# EasyEDA schematic SCH_STM32F401CCU6_UNI.json
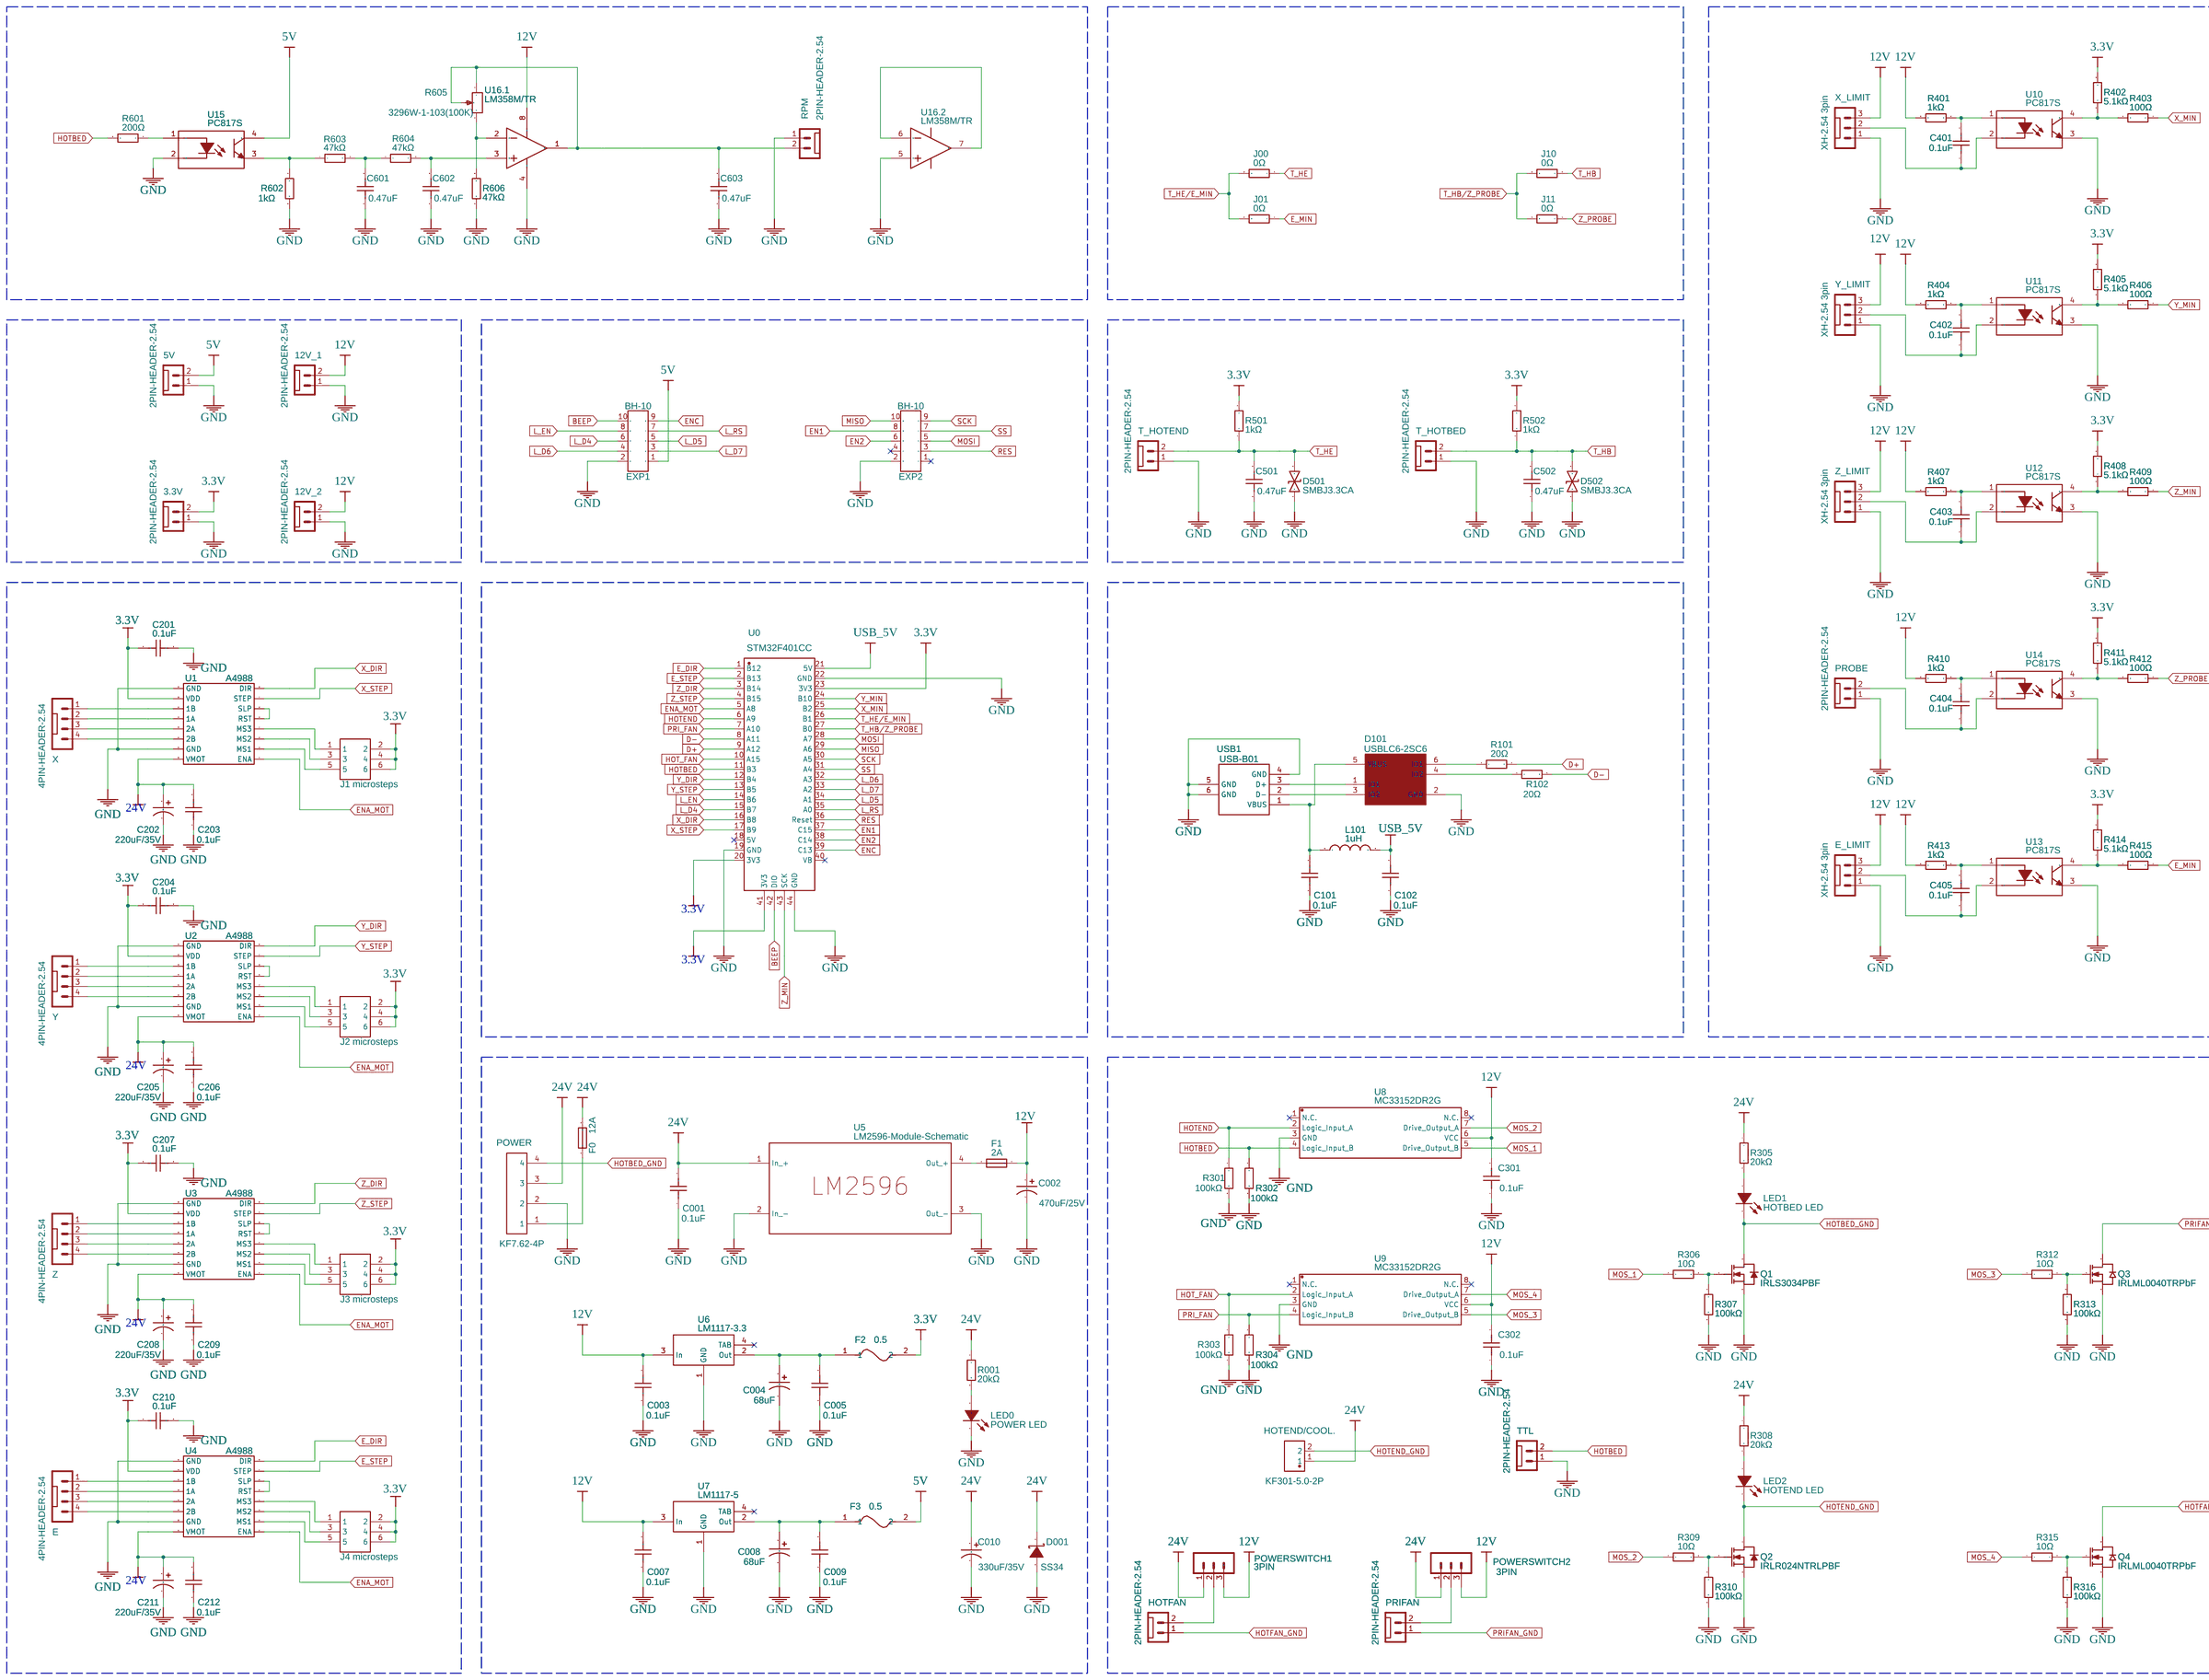
[diagram p0: schematic sheet]

## Parts
3.3V  2PIN-HEADER-2.54  [JST-2.54-2PIN-CONNECTOR]
5V  2PIN-HEADER-2.54  [JST-2.54-2PIN-CONNECTOR]
12V_1  2PIN-HEADER-2.54  [JST-2.54-2PIN-CONNECTOR]
12V_2  2PIN-HEADER-2.54  [JST-2.54-2PIN-CONNECTOR]
C001  0.1uF  [C0805]
C002  470uF/25V  [CAP-TH_W10.0_P5.0_D0.6_220UF_35V]
C003  0.1uF  [C0805]
C004  68uF  [CASE-B_3528]
C005  0.1uF  [C0805]
C007  0.1uF  [C0805]
C008  68uF  [CASE-B_3528]
C009  0.1uF  [C0805]
C010  330uF/35V  [CAP-TH_W10.0_P5.0_D0.6_220UF_35V]
C101  0.1uF  [C0805]
C102  0.1uF  [C0805]
C201  0.1uF  [C0805]
C202  220uF/35V  [CAP-TH_W8.0_P3.5_D0.6_220UF_35V]
C203  0.1uF  [C0805]
C204  0.1uF  [C0805]
C205  220uF/35V  [CAP-TH_W8.0_P3.5_D0.6_220UF_35V]
C206  0.1uF  [C0805]
C207  0.1uF  [C0805]
C208  220uF/35V  [CAP-TH_W8.0_P3.5_D0.6_220UF_35V]
C209  0.1uF  [C0805]
C210  0.1uF  [C0805]
C211  220uF/35V  [CAP-TH_W8.0_P3.5_D0.6_220UF_35V]
C212  0.1uF  [C0805]
C301  0.1uF  [C0805]
C302  0.1uF  [C0805]
C401  0.1uF  [C0805]
C402  0.1uF  [C0805]
C403  0.1uF  [C0805]
C404  0.1uF  [C0805]
C405  0.1uF  [C0805]
C501  0.47uF  [1206]
C502  0.47uF  [1206]
C601  0.47uF  [1206]
C602  0.47uF  [1206]
C603  0.47uF  [1206]
D001  SS34  [SMA_L4.3-W2.6-LS5.2-RD]
D101  USBLC6-2SC6  [SOT-23-6]
D501  SMBJ3.3CA  [SMB_L4.4-W3.6-LS5.3-BI]
D502  SMBJ3.3CA  [SMB_L4.4-W3.6-LS5.3-BI]
E  4PIN-HEADER-2.54  [CON-XH2.54-4PIN]
E_LIMIT  XH-2.54 3pin  [CONN-TH_XH2.54_3PIN]
EXP1  BH-10  [BH-10_ATMEL]
EXP2  BH-10  [BH-10_ATMEL]
F0  12A  [FUSE-SMD_L6.1-W2.7]
F1  2A  [FUSE-SMD_L6.1-W2.7]
F2  0.5  [SMD RESETABLE FUSE 3216]
F3  0.5  [SMD RESETABLE FUSE 3216]
HOTEND/COOL.  KF301-5.0-2P  [CONN-TH_P5.00_KF301-5.0-2P]
HOTFAN  2PIN-HEADER-2.54  [JST-2.54-2PIN-CONNECTOR]
J00  0Ω  [R0805]
J1  microsteps  [HDR-2X3-2.54-MALE]
J2  microsteps  [HDR-2X3-2.54-MALE]
J3  microsteps  [HDR-2X3-2.54-MALE]
J4  microsteps  [HDR-2X3-2.54-MALE]
J10  0Ω  [R0805]
J11  0Ω  [R0805]
L101  1uH  [INDUCTOR-1206]
LED0  POWER LED  [LED1206-R-RD]
LED1  HOTBED LED  [LED1206-R-RD]
LED2  HOTEND LED  [LED1206-R-RD]
POWER  KF7.62-4P  [KF7.62-4P]
POWERSWITCH1  3PIN  [3PIN-HEADER]
POWERSWITCH2  3PIN  [3PIN-HEADER]
PRIFAN  2PIN-HEADER-2.54  [JST-2.54-2PIN-CONNECTOR]
PROBE  2PIN-HEADER-2.54  [JST-2.54-2PIN-CONNECTOR]
Q1  IRLS3034PBF  [IRLS3034PBF_D2PAK]
Q2  IRLR024NTRLPBF  [DPAK_L6.5-W6.0-P2.29-LS9.9-TL]
Q3  IRLML0040TRPbF  [SOT-23_L2.9-W1.3-P1.90-LS2.4-BR]
Q4  IRLML0040TRPbF  [SOT-23_L2.9-W1.3-P1.90-LS2.4-BR]
R001  20kΩ  [R0805]
R101  20Ω  [R0805]
R102  20Ω  [R0805]
R301  100kΩ  [R0805]
R302  100kΩ  [R0805]
R303  100kΩ  [R0805]
R304  100kΩ  [R0805]
R305  20kΩ  [R0805]
R306  10Ω  [R0805]
R307  100kΩ  [R0805]
R308  20kΩ  [R0805]
R309  10Ω  [R0805]
R310  100kΩ  [R0805]
R312  10Ω  [R0805]
R313  100kΩ  [R0805]
R315  10Ω  [R0805]
R316  100kΩ  [R0805]
R401  1kΩ  [R0805]
R402  5.1kΩ  [R0805]
R403  100Ω  [R0805]
R404  1kΩ  [R0805]
R405  5.1kΩ  [R0805]
R406  100Ω  [R0805]
R407  1kΩ  [R0805]
R408  5.1kΩ  [R0805]
R409  100Ω  [R0805]
R410  1kΩ  [R0805]
R411  5.1kΩ  [R0805]
R412  100Ω  [R0805]
R413  1kΩ  [R0805]
R414  5.1kΩ  [R0805]
R415  100Ω  [R0805]
R501  1kΩ  [R0805]
R502  1kΩ  [R0805]
R601  200Ω  [R0805]
R602  1kΩ  [R0805]
R603  47kΩ  [R0805]
R604  47kΩ  [R0805]
R605  3296W-1-103(100K)  [RES-ADJ-TH_3296W]
R606  47kΩ  [R0805]
RPM  2PIN-HEADER-2.54  [JST-2.54-2PIN-CONNECTOR]
T_HOTBED  2PIN-HEADER-2.54  [JST-2.54-2PIN-CONNECTOR]
T_HOTEND  2PIN-HEADER-2.54  [JST-2.54-2PIN-CONNECTOR]
TTL  2PIN-HEADER-2.54  [JST-2.54-2PIN-CONNECTOR]
U0  STM32F401CC  [STM32F401CC-WEACTBOARD-FOOTPRINT]
U1  A4988  [A4988]
U2  A4988  [A4988]
U3  A4988  [A4988]
U4  A4988  [A4988]
U5  LM2596-Module-Schematic  [LM2596-MODULE-SLS]
U6  LM1117-3.3  [LM1117-3.3]
U7  LM1117-5  [LM1117-3.3]
U8  MC33152DR2G  [SOIC-8_L4.9-W3.9-P1.27-LS6.0-BL]
U9  MC33152DR2G  [SOIC-8_L4.9-W3.9-P1.27-LS6.0-BL]
U10  PC817S  [SMD-4_L4.6-W6.5-P2.54-LS10.2-BL]
U11  PC817S  [SMD-4_L4.6-W6.5-P2.54-LS10.2-BL]
U12  PC817S  [SMD-4_L4.6-W6.5-P2.54-LS10.2-BL]
U13  PC817S  [SMD-4_L4.6-W6.5-P2.54-LS10.2-BL]
U14  PC817S  [SMD-4_L4.6-W6.5-P2.54-LS10.2-BL]
U15  PC817S  [SMD-4_L4.6-W6.5-P2.54-LS10.2-BL]
U16  LM358M/TR  [SOP-8_L4.9-W3.9-P1.27-LS6.0-BL]  (sections 1,2)
USB1  USB-B01  [USB-B-TH_USB-B01]
X  4PIN-HEADER-2.54  [CON-XH2.54-4PIN]
X_LIMIT  XH-2.54 3pin  [CONN-TH_XH2.54_3PIN]
Y  4PIN-HEADER-2.54  [CON-XH2.54-4PIN]
Y_LIMIT  XH-2.54 3pin  [CONN-TH_XH2.54_3PIN]
Z  4PIN-HEADER-2.54  [CON-XH2.54-4PIN]
Z_LIMIT  XH-2.54 3pin  [CONN-TH_XH2.54_3PIN]

## Library data of the parts
3.3V 5V 12V_1 12V_2 HOTFAN PRIFAN PROBE RPM T_HOTBED T_HOTEND TTL = 2PIN-HEADER-2.54: Contributor: Aleksandr Fateev
C001 C003 C005 C007 C009 C101 C102 C201 C203 C204 C206 C207 C209 C210 C212 C301 C302 C401-C405 C501 C502 C601-C603 = Capacitor 1206: Supplier: RS-Online; Contributor: thib.dls
C002 C010 C202 C205 C208 C211 = Electrolytic Capacitor 220uF/35V: Manufacturer: Panasonic; Manufacturer Part: EEUTP1V221; Contributor: Emanuil
C004 C008 = TPSB686K010R0600: Supplier: LCSC; Supplier Part: C444793; Manufacturer: AVX; Contributor: LCSC
D001 = SS16: Supplier: LCSC; Manufacturer: MDD; image: //image.lceda.cn/szlcsc/C2481.jpg; Supplier Part: C2481; JLCPCB Part Class: Extended Part; Contributor: Roman
D101 = USBLC6-2SC6: Supplier: LCSC; Manufacturer: STMicroelectronics; image: //image.lceda.cn/szlcsc/C7519.jpg; Contributor: Harsimran Sindhar; Supplier Part: C7519
D501 D502 = SMBJ3.3CA_C2917866: Supplier: LCSC; Supplier Part: C2917866; Manufacturer: ZHIDE(志得); Contributor: lcsc
E X Y Z = 4PIN-HEADER-2.54: Contributor: Aleksandr Fateev
E_LIMIT X_LIMIT Y_LIMIT Z_LIMIT = 3PIN-HEADER-2.54: Contributor: Aleksandr Fateev
EXP1 EXP2 = BH-10: Manufacturer Part: BH-10(IDC-10MS); Contributor: gp01
F0 F1 = 0448008.MR: Supplier: LCSC; Supplier Part: C187548; Manufacturer: Littelfuse; Contributor: LCSC; JLCPCB Part Class: Extended Part
F2 F3 = smd resetable fuse 3216: Contributor: markuni
HOTEND/COOL. = KF301-5.0-2P: Supplier: LCSC; Supplier Part: C474881; Manufacturer: Cixi Kefa Elec; Contributor: LCSC; JLCPCB Part Class: Extended Part
J00 J10 J11 R001 R101 R102 R301-R310 R312 R313 R315 R316 R401-R415 R501 R502 R601-R604 R606 = 200Ω: Power: 1/4W; Tolerance: ±1%; Supplier Part: C18002; Supplier: LCSC; Manufacturer: UniOhm; Manufacturer Part: 1206W4F2000T5E
J1-J4 = HRD-2X3-2.54-MALE: Manufacturer Part: HRD-2x23-2.54-MALE; Contributor: loki231
L101 = INDUCTORH1206: Inductors
LED0-LED2 = KT-1206Red LED: Supplier: LCSC; Manufacturer: KENTO; Supplier Part: C49018; JLCPCB Part Class: Extended Part
POWER = KF7.62-4P: Contributor: tunx404
POWERSWITCH1 POWERSWITCH2 = 3PIN-HEADER: Contributor: hien nguyen huu
Q1 = IRLS3034PBF: Supplier: LCSC; Manufacturer: IR; image: //image.lceda.cn/szlcsc/C22162.jpg; Supplier Part: C22162; link: https://static.chipdip.ru/lib/292/DOC000292754.pdf; Contributor: Filya_Filius
Q2 = IRLR024NTRLPBF: Supplier: LCSC; Supplier Part: C538161; Manufacturer: Infineon Technologies; Contributor: LCSC; JLCPCB Part Class: Extended Part
Q3 Q4 = AO3400-SOT23: Supplier: LCSC; Supplier Part: C332101; Manufacturer: PUOLOP; Contributor: LCSC; JLCPCB Part Class: Extended Part
R605 = Precision adjustable resistance 3296W-1-304(300K): Supplier Part: C62174; Supplier: LCSC; Manufacturer: ReliaPro; JLCPCB Part Class: Extended Part
U0 = STM32F401CC-WeActBoard: Manufacturer: WeActBoard; Manufacturer Part: WeActBoard; Supplier Part: NA; Contributor: egen donchenko
U1-U4 = A4988: Contributor: maker09
U5 = LM2596-Module-Schematic: Contributor: mark5094387dg0f9834lsd787
U6 U7 = LM1117-3.3: Contributor: cpu76239
U8 U9 = MC33152DR2G: Supplier: LCSC; Manufacturer: ON; Supplier Part: C12160; JLCPCB Part Class: Extended Part
U10-U15 = PC817S: Supplier: LCSC; Supplier Part: C490097; Manufacturer: Wuxi China Resources Huajing Microelectronics; Contributor: LCSC; JLCPCB Part Class: Extended Part
U16 = LM358M/TR: Supplier: LCSC; Supplier Part: C398078; Manufacturer: HGSEMI; subpart_no: 1
USB1 = USB-B01: Supplier: LCSC; Supplier Part: C498173; Manufacturer: SOFNG; Contributor: joselcl98 (joselcl98); JLCPCB Part Class: Extended Part

## Nets
3.3V: 3.3V.2 C201.1 C204.1 C207.1 C210.1 F2.2 J1.2 J1.4 J1.6 J2.2 J2.4 J2.6 J3.2 J3.4 J3.6 J4.2 J4.4 J4.6 R402.2 R405.2 R408.2 R411.2 R414.2 R501.2 R502.2 U0.20(3V3) U0.23(3V3) U0.41(3V3) U1.15(VDD) U2.15(VDD) U3.15(VDD) U4.15(VDD)
5V: 5V.2 EXP1.1 F3.2 U15.4(COL)
12V: 12V_1.2 12V_2.2 C002.2 C003.2 C007.2 C301.2 C302.2 E_LIMIT.3 F1.1 POWERSWITCH1.3 POWERSWITCH2.3 R401.2 R404.2 R407.2 R410.2 R413.2 U6.3(In) U7.3(In) U8.6(VCC) U9.6(VCC) U16.8(VCC) X_LIMIT.3 Y_LIMIT.3 Z_LIMIT.3
24V: C001.2 C010.2 C202.2 C203.2 C205.2 C206.2 C208.2 C209.2 C211.2 C212.2 D001.1(K) F0.2 HOTEND/COOL..1 POWER.3 POWERSWITCH1.1 POWERSWITCH2.1 R001.1 R305.1 R308.1 U1.9(VMOT) U2.9(VMOT) U3.9(VMOT) U4.9(VMOT) U5.1(In +)
GND: 3.3V.1 5V.1 12V_1.1 12V_2.1 C001.1 C002.1 C003.1 C004.2 C005.1 C007.1 C008.2 C009.1 C010.1 C101.1 C102.1 C201.2 C202.1 C203.1 C204.2 C205.1 C206.1 C207.2 C208.1 C209.1 C210.2 C211.1 C212.1 C301.1 C302.1 C501.1 C502.1 C601.1 C602.1 C603.1 D001.2(A) D101.2(GND) D501.1 D502.1 E_LIMIT.1 EXP1.2 EXP2.2 LED0.2(K) POWER.2 PROBE.1 Q1.2(S) Q2.3(S) Q3.2(S) Q4.2(S) R301.2 R302.2 R303.2 R304.2 R307.2 R310.2 R313.2 R316.2 R602.2 R606.1 RPM.1 T_HOTBED.1 T_HOTEND.1 TTL.1 U0.19(GND) U0.22(GND) U0.44(GND) U1.10(GND) U1.16(GND) U2.10(GND) U2.16(GND) U3.10(GND) U3.16(GND) U4.10(GND) U4.16(GND) U5.2(In -) U5.3(Out -) U6.1(GND) U7.1(GND) U8.3(GND) U9.3(GND) U10.3(EM) U11.3(EM) U12.3(EM) U13.3(EM) U14.3(EM) U15.2(CAT) U16.4(GND) U16.5(2IN+) USB1.4(GND) USB1.5(GND) USB1.6(GND) X_LIMIT.1 Y_LIMIT.1 Z_LIMIT.1
BEEP: EXP1.10 U0.42(DIO)
D+: R101.2 U0.9(A12)
D-: R102.2 U0.8(A11)
E_DIR: U0.1(B12) U4.8(DIR)
E_MIN: R415.1
E_STEP: U0.2(B13) U4.7(STEP)
EN1: EXP2.8 U0.37(C15)
EN2: EXP2.6 U0.38(C14)
ENA_MOT: U0.5(A8) U1.1(ENA) U2.1(ENA) U3.1(ENA) U4.1(ENA)
ENC: EXP1.9 U0.39(C13)
HOT_FAN: R303.1 U0.10(A15) U9.2(Logic Input A)
HOTBED: R302.1 R601.2 TTL.2 U0.11(B3) U8.4(Logic Input B)
HOTBED_GND: LED1.2(K) POWER.4 Q1.3(D)
HOTEND: R301.1 U0.6(A9) U8.2(Logic Input A)
HOTEND_GND: HOTEND/COOL..2 LED2.2(K) Q2.4(D)
HOTFAN_GND: HOTFAN.1 Q4.3(D)
L_D4: EXP1.6 U0.15(B7)
L_D5: EXP1.5 U0.34(A1)
L_D6: EXP1.4 U0.32(A3)
L_D7: EXP1.3 U0.33(A2)
L_EN: EXP1.8 U0.14(B6)
L_RS: EXP1.7 U0.35(A0)
MISO: EXP2.10 U0.29(A6)
MOS_1: R306.1 U8.5(Drive Output B)
MOS_2: R309.1 U8.7(Drive Output A)
MOS_3: R312.1 U9.5(Drive Output B)
MOS_4: R315.1 U9.7(Drive Output A)
MOSI: EXP2.5 U0.28(A7)
PRI_FAN: R304.1 U0.7(A10) U9.4(Logic Input B)
PRIFAN_GND: PRIFAN.1 Q3.3(D)
RES: EXP2.3 U0.36(Reset)
SCK: EXP2.9 U0.30(A5)
SS: EXP2.7 U0.31(A4)
T_HB: C502.2 D502.2 J10.1 R502.1 T_HOTBED.2
T_HB/Z_PROBE: J10.2 J11.2 U0.27(B0)
T_HE: C501.2 D501.2 J00.1 R501.1 T_HOTEND.2
T_HE/E_MIN: J00.2 U0.26(B1)
USB_5V: C102.2 L101.P$2(2) U0.21(5V)
X_DIR: U0.16(B8) U1.8(DIR)
X_MIN: R403.1 U0.25(B2)
X_STEP: U0.17(B9) U1.7(STEP)
Y_DIR: U0.12(B4) U2.8(DIR)
Y_MIN: R406.1 U0.24(B10)
Y_STEP: U0.13(B5) U2.7(STEP)
Z_DIR: U0.3(B14) U3.8(DIR)
Z_MIN: R409.1 U0.43(SCK)
Z_PROBE: J11.1 R412.1
Z_STEP: U0.4(B15) U3.7(STEP)
Net-(C004-1): C004.1 C005.2 F2.1 U6.2(Out)
Net-(C008-1): C008.1 C009.2 F3.1 U7.2(Out)
Net-(C101-2): C101.2 D101.5(VBUS) L101.P$1(1) USB1.1(VBUS)
Net-(C401-1): C401.1 U10.2(CAT) X_LIMIT.2
Net-(C401-2): C401.2 R401.1 U10.1(AN)
Net-(C402-1): C402.1 U11.2(CAT) Y_LIMIT.2
Net-(C402-2): C402.2 R404.1 U11.1(AN)
Net-(C403-1): C403.1 U12.2(CAT) Z_LIMIT.2
Net-(C403-2): C403.2 R407.1 U12.1(AN)
Net-(C404-1): C404.1 PROBE.2 U14.2(CAT)
Net-(C404-2): C404.2 R410.1 U14.1(AN)
Net-(C405-1): C405.1 E_LIMIT.2 U13.2(CAT)
Net-(C405-2): C405.2 R413.1 U13.1(AN)
Net-(C601-2): C601.2 R603.2 R604.1
Net-(C602-2): C602.2 R604.2 U16.3(1IN+)
Net-(C603-2): C603.2 R605.1 R605.2 RPM.2 U16.1(1OUT)
Net-(D101-1): D101.1(IO1) USB1.3(D+)
Net-(D101-3): D101.3(IO2) USB1.2(D-)
Net-(D101-4): D101.4(IO2) R102.1
Net-(D101-6): D101.6(IO1) R101.1
Net-(E-1): E.1 U4.14(1B)
Net-(E-2): E.2 U4.13(1A)
Net-(E-3): E.3 U4.12(2A)
Net-(E-4): E.4 U4.11(2B)
Net-(F0-1): F0.1 POWER.1
Net-(F1-2): F1.2 U5.4(Out +)
Net-(HOTFAN-2): HOTFAN.2 POWERSWITCH1.2
Net-(J1-1): J1.1 U1.4(MS3)
Net-(J1-3): J1.3 U1.3(MS2)
Net-(J1-5): J1.5 U1.2(MS1)
Net-(J2-1): J2.1 U2.4(MS3)
Net-(J2-3): J2.3 U2.3(MS2)
Net-(J2-5): J2.5 U2.2(MS1)
Net-(J3-1): J3.1 U3.4(MS3)
Net-(J3-3): J3.3 U3.3(MS2)
Net-(J3-5): J3.5 U3.2(MS1)
Net-(J4-1): J4.1 U4.4(MS3)
Net-(J4-3): J4.3 U4.3(MS2)
Net-(J4-5): J4.5 U4.2(MS1)
Net-(LED0-1): LED0.1(A) R001.2
Net-(LED1-1): LED1.1(A) R305.2
Net-(LED2-1): LED2.1(A) R308.2
Net-(POWERSWITCH2-2): POWERSWITCH2.2 PRIFAN.2
Net-(Q1-1): Q1.1(G) R306.2 R307.1
Net-(Q2-1): Q2.1(G) R309.2 R310.1
Net-(Q3-1): Q3.1(G) R312.2 R313.1
Net-(Q4-1): Q4.1(G) R315.2 R316.1
Net-(R402-1): R402.1 R403.2 U10.4(COL)
Net-(R405-1): R405.1 R406.2 U11.4(COL)
Net-(R408-1): R408.1 R409.2 U12.4(COL)
Net-(R411-1): R411.1 R412.2 U14.4(COL)
Net-(R414-1): R414.1 R415.2 U13.4(COL)
Net-(R601-1): R601.1 U15.1(AN)
Net-(R602-1): R602.1 R603.1 U15.3(EM)
Net-(R605-3): R605.3 R606.2 U16.2(1IN-)
Net-(U1-5): U1.5(RST) U1.6(SLP)
Net-(U1-11): U1.11(2B) X.4
Net-(U1-12): U1.12(2A) X.3
Net-(U1-13): U1.13(1A) X.2
Net-(U1-14): U1.14(1B) X.1
Net-(U2-5): U2.5(RST) U2.6(SLP)
Net-(U2-11): U2.11(2B) Y.4
Net-(U2-12): U2.12(2A) Y.3
Net-(U2-13): U2.13(1A) Y.2
Net-(U2-14): U2.14(1B) Y.1
Net-(U3-5): U3.5(RST) U3.6(SLP)
Net-(U3-11): U3.11(2B) Z.4
Net-(U3-12): U3.12(2A) Z.3
Net-(U3-13): U3.13(1A) Z.2
Net-(U3-14): U3.14(1B) Z.1
Net-(U4-5): U4.5(RST) U4.6(SLP)
Net-(U16.2-6): U16.6(2IN-) U16.7(2OUT)

Not connected (* = marked no-connect by the designer): EXP2 1* 4*; U0 18(5V)* 40(VB)*; U6 4(TAB)*; U7 4(TAB)*; U8 1(N.C.)* 8(N.C.)*; U9 1(N.C.)* 8(N.C.)*
